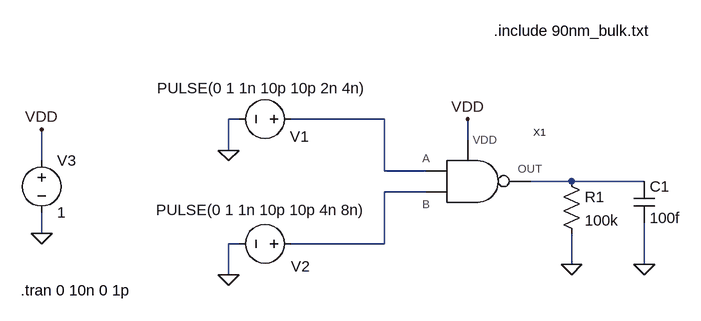
[diagram p0: schematic test-nand.asc]
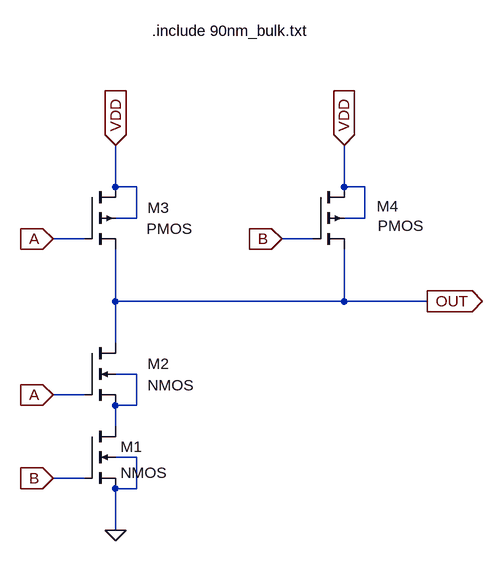
[diagram p1: sub-circuit my-nand.asc]
test-nand.asc, the LTspice schematic file:
Version 4
SHEET 1 880 680
WIRE -176 80 -192 80
WIRE 48 80 -96 80
WIRE 176 112 176 80
WIRE -192 128 -192 80
WIRE -480 144 -480 96
WIRE 48 160 48 80
WIRE 112 160 48 160
WIRE 336 176 272 176
WIRE 448 176 336 176
WIRE 112 192 48 192
WIRE -480 256 -480 224
WIRE -176 272 -192 272
WIRE 48 272 48 192
WIRE 48 272 -96 272
WIRE 336 304 336 256
WIRE 448 304 448 240
WIRE -192 320 -192 272
FLAG -480 256 0
FLAG -192 128 0
FLAG -192 320 0
FLAG -480 96 VDD
FLAG 176 80 VDD
FLAG 336 304 0
FLAG 448 304 0
SYMBOL voltage -80 80 R90
WINDOW 0 27 -12 VRight 2
WINDOW 3 -48 -102 VRight 2
WINDOW 123 0 0 Left 0
WINDOW 39 0 0 Left 0
SYMATTR InstName V1
SYMATTR Value PULSE(0 1 1n 10p 10p 2n 4n)
SYMBOL voltage -80 272 R90
WINDOW 0 35 -13 VRight 2
WINDOW 3 -52 -100 VRight 2
WINDOW 123 0 0 Left 0
WINDOW 39 0 0 Left 0
SYMATTR InstName V2
SYMATTR Value PULSE(0 1 1n 10p 10p 4n 8n)
SYMBOL voltage -480 128 R0
WINDOW 123 0 0 Left 0
WINDOW 39 0 0 Left 0
SYMATTR InstName V3
SYMATTR Value 1
SYMBOL res 320 160 R0
SYMATTR InstName R1
SYMATTR Value 100k
SYMBOL cap 432 176 R0
SYMATTR InstName C1
SYMATTR Value 100f
SYMBOL my-nand 176 176 R0
SYMATTR InstName X1
TEXT 216 -56 Left 2 !.include 90nm_bulk.txt
TEXT -512 344 Left 2 !.tran 0 10n 0 1p

my-nand.asc, the sub-circuit schematic file:
Version 4
SHEET 1 924 680
WIRE 224 16 224 -48
WIRE 256 16 224 16
WIRE 576 16 576 -48
WIRE 608 16 576 16
WIRE 256 64 256 16
WIRE 256 64 224 64
WIRE 608 64 608 16
WIRE 608 64 576 64
WIRE 176 96 128 96
WIRE 528 96 480 96
WIRE 224 192 224 112
WIRE 576 192 576 112
WIRE 576 192 224 192
WIRE 704 192 576 192
WIRE 224 256 224 192
WIRE 256 304 224 304
WIRE 176 336 128 336
WIRE 256 352 256 304
WIRE 256 352 224 352
WIRE 224 384 224 352
WIRE 256 432 224 432
WIRE 176 464 128 464
WIRE 256 480 256 432
WIRE 256 480 224 480
WIRE 224 544 224 480
FLAG 576 -48 VDD
IOPIN 576 -48 In
FLAG 224 -48 VDD
IOPIN 224 -48 In
FLAG 704 192 OUT
IOPIN 704 192 Out
FLAG 128 96 A
IOPIN 128 96 In
FLAG 128 336 A
IOPIN 128 336 In
FLAG 480 96 B
IOPIN 480 96 In
FLAG 128 464 B
IOPIN 128 464 In
FLAG 224 544 0
SYMBOL nmos4 176 384 R0
SYMATTR InstName M1
SYMATTR Value2 l=90n w=200n
SYMBOL nmos4 176 256 R0
WINDOW 0 97 32 Left 2
WINDOW 3 97 65 Left 2
SYMATTR InstName M2
SYMATTR Value2 l=90n w=200n
SYMBOL pmos4 176 16 R0
WINDOW 0 97 32 Left 2
WINDOW 3 96 64 Left 2
SYMATTR InstName M3
SYMATTR Value2 l=90n w=400n
SYMBOL pmos4 528 16 R0
WINDOW 0 98 30 Left 2
WINDOW 3 100 60 Left 2
SYMATTR InstName M4
SYMATTR Value2 l=90n w=400n
TEXT 280 -224 Left 2 !.include 90nm_bulk.txt

The netlist it stands for:
* test-nand.asc
V1 N001 0 PULSE(0 1 1n 10p 10p 2n 4n)
V2 N003 0 PULSE(0 1 1n 10p 10p 4n 8n)
V3 VDD 0 1
R1 N002 0 100k
C1 N002 0 100f
XX1 N002 N001 N003 VDD my-nand

* block symbol definitions
.subckt my-nand OUT A B VDD
M1 N001 B 0 0 NMOS l=90n w=200n
M2 OUT A N001 N001 NMOS l=90n w=200n
M3 VDD A OUT VDD PMOS l=90n w=400n
M4 VDD B OUT VDD PMOS l=90n w=400n
.include 90nm_bulk.txt
.ends my-nand

.model NMOS NMOS
.model PMOS PMOS
.lib standard.mos
.include 90nm_bulk.txt
.tran 0 10n 0 1p
.backanno
.end